# EAGLE design breakout32u2 (EAGLE 5.12)
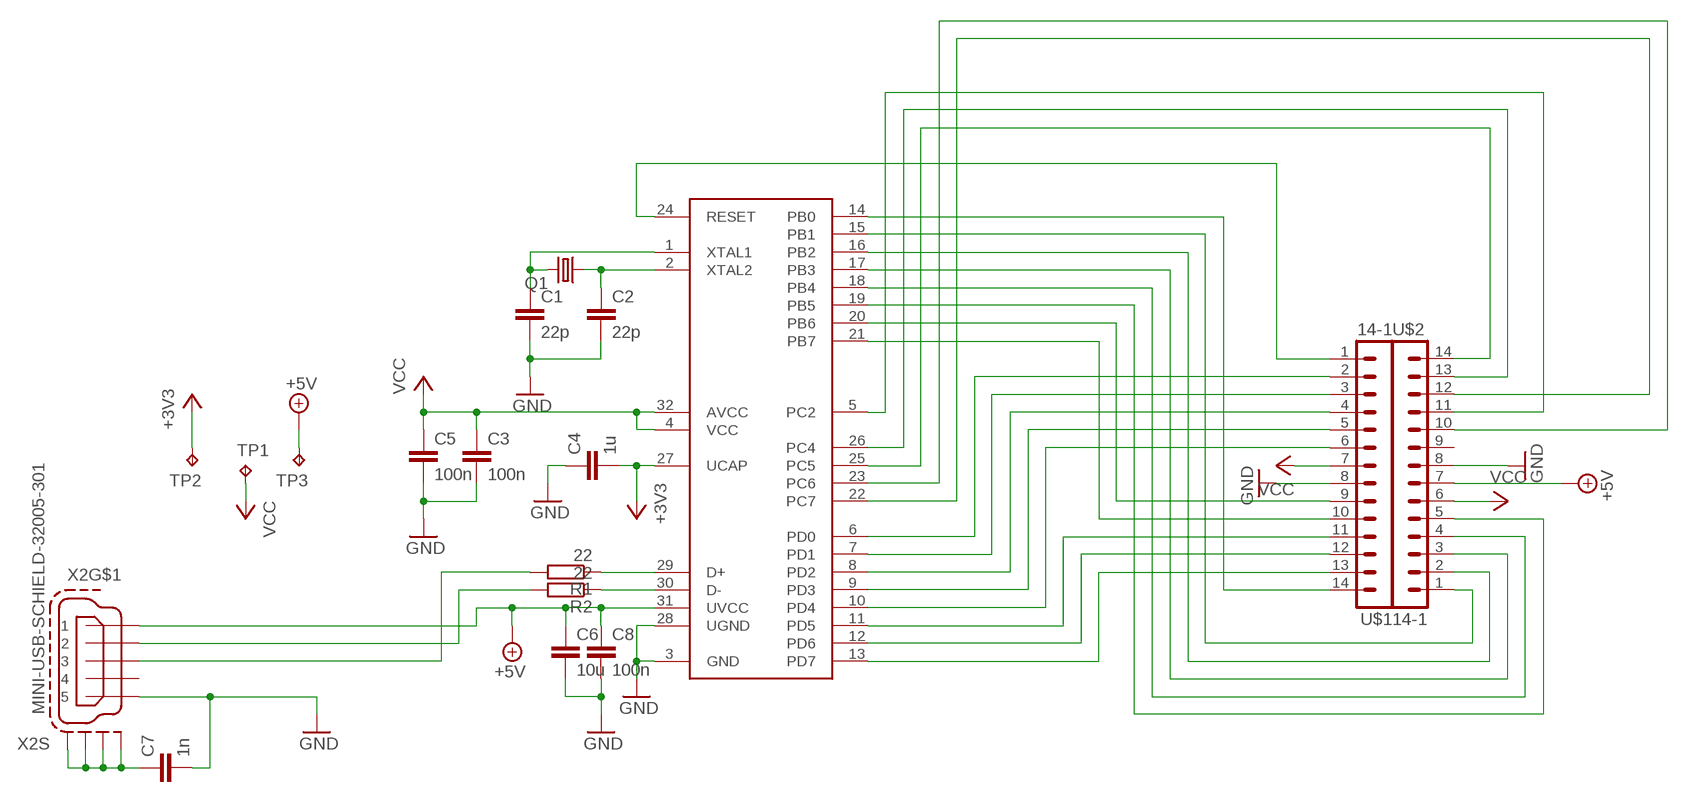
[diagram p0: schematic, sheet 1]

## Parts
C1  22p  C-EUC0805K  [C0805K]
C2  22p  C-EUC0805K  [C0805K]
C3  100n  C-EUC0805K  [C0805K]
C4  1u  C-EUC0805K  [C0805K]
C5  100n  C-EUC0805K  [C0805K]
C6  10u  C-EUC0805K  [C0805K]
C7  1n  C-EUC0805K  [C0805K]
C8  100n  C-EUC0805K  [C0805K]
IC1  ATMEGA32U2  AT90USB162  [VQFP32]
Q1  CRYSTALHC49U-V  [HC49U-V]
R1  22  R-EU_M0805  [M0805]
R2  22  R-EU_M0805  [M0805]
TP1  TPTP08SQ  [TP08SQ]
TP2  TPTP08SQ  [TP08SQ]
TP3  TPTP08SQ  [TP08SQ]
U$1  14-1  [14-1]
U$2  14-1  [14-1]
X2  MINI-USB-SCHIELD-32005-301  [32005-301]

## Nets
+3V3: C4.2 IC1.27(UCAP) TP2.TP
+5V: C6.1 C8.1 IC1.31(UVCC) TP3.TP U$2.7 X2.1
GND: C1.2 C2.2 C3.2 C4.1 C5.2 C6.2 C7.2 C8.2 IC1.3(GND) IC1.28(UGND) U$1.8 U$2.8 X2.5
N$1: IC1.29(D+) R1.1
N$2: IC1.30(D-) R2.1
N$3: C7.1 X2.M1(S:S1) X2.M2(S:S2) X2.M3(S:S3) X2.M4(S:S4)
N$5: C1.1 IC1.1(XTAL1) Q1.2
N$6: R2.2 X2.2
N$7: R1.2 X2.3
N$8: IC1.24(RESET) U$1.1
N$9: IC1.14(PB0) U$1.14
N$10: IC1.15(PB1) U$2.1
N$11: IC1.16(PB2) U$2.2
N$12: IC1.17(PB3) U$2.3
N$13: IC1.18(PB4) U$2.4
N$14: IC1.19(PB5) U$2.5
N$15: IC1.20(PB6) U$1.9
N$16: IC1.21(PB7) U$1.10
N$17: IC1.6(PD0) U$1.2
N$18: IC1.7(PD1) U$1.3
N$19: IC1.8(PD2) U$1.4
N$20: IC1.9(PD3) U$1.5
N$21: IC1.10(PD4) U$1.6
N$22: IC1.11(PD5) U$1.11
N$23: IC1.12(PD6) U$1.12
N$24: IC1.13(PD7) U$1.13
N$25: IC1.5(PC2) U$2.11
N$26: IC1.26(PC4) U$2.13
N$27: IC1.25(PC5) U$2.14
N$28: IC1.23(PC6) U$2.10
N$29: IC1.22(PC7) U$2.12
N$30: C2.1 IC1.2(XTAL2) Q1.1
VCC: C3.1 C5.1 IC1.4(VCC) IC1.32(AVCC) TP1.TP U$1.7 U$2.6
Unconnected: U$2.9 X2.4

## Library data of the parts
C1-C8 = rcl:C-EU: CAPACITOR, European symbol
IC1 = at90usb:AT90USB162
Q1 = crystal:CRYSTAL: CRYSTAL; OC_FARNELL: 1666969; OC_NEWARK: unknown
R1 R2 = rcl:R-EU_: RESISTOR, European symbol
TP1-TP3 = testpad:TP: Test pad
U$1 U$2 = adi__con-lstb:14-1
X2 = con-cypressindustries:MINI-USB-SCHIELD-: MINI USB-B Conector Source: www.cypressindustries.com; OC_FARNELL: unknown; OC_NEWARK: unknown

## Board
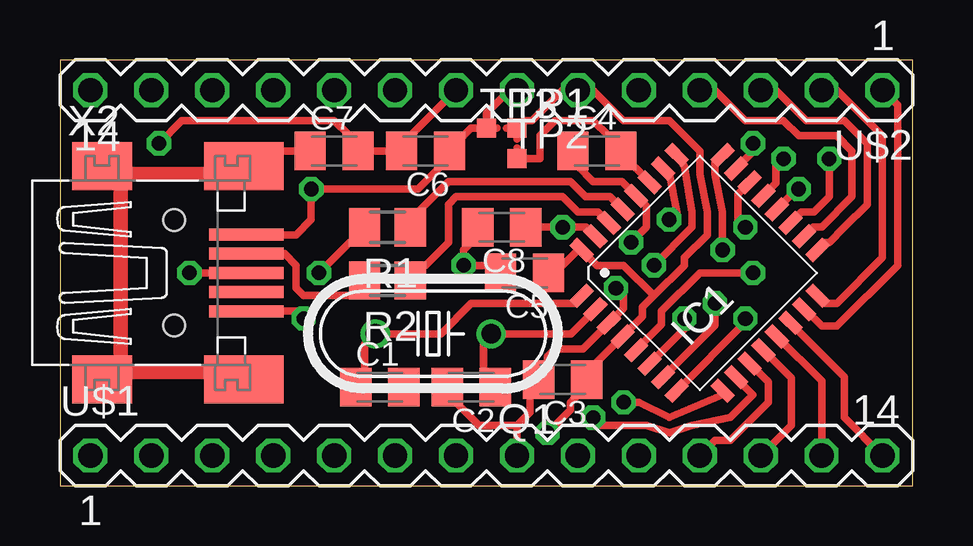
[diagram p1: board, top side]
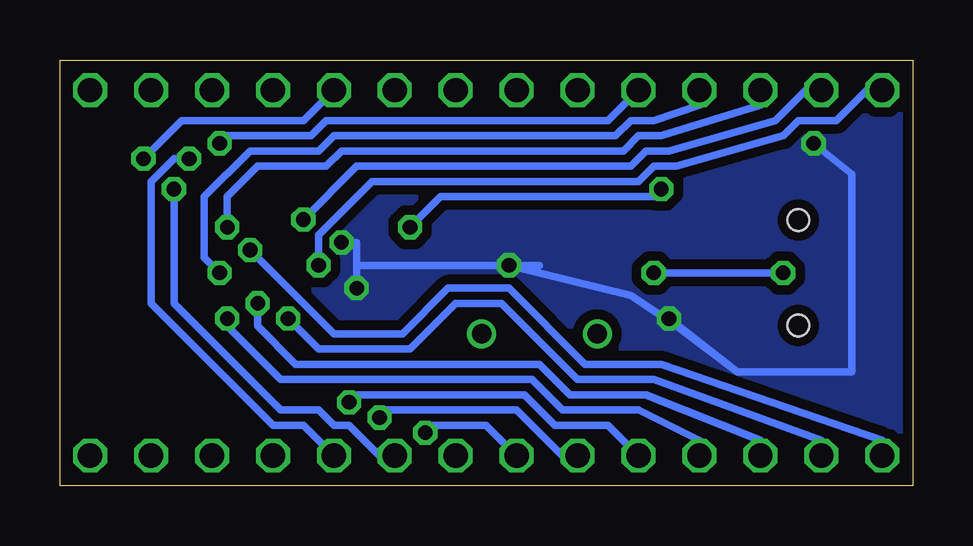
[diagram p2: board, bottom side, seen from below]

Size 35.55 x 17.77 mm. Coordinates in mm from the lower left corner, seen from the top.
Outline: 0,0 35.55,0 35.55,17.77 0,17.77 0,0
Copper layers (1*16): Top 0.035mm / dielectric 1.5mm / Bottom 0.035mm
Design rules "default": minimum track width 0.2mm, minimum drill 0.5mm, track to track 0.2mm, track to pad 0.2mm, pad to pad 0.15mm, via to via 0.2mm, smd to smd 0mil, copper to edge 0.2mm, drill to drill 0.2mm, minimum pad ring 0.2mm, minimum via ring 0.2mm, stop-mask expansion 0.1mm, vias tented up to drill 0mil, thermal gap 10mil

### Footprints (pad centres in the part's own frame; a part is rotated, then mirrored left to right if it is on the bottom)
C0805K = smd 1.3 x 1.6: 1 -1,0; 2 1,0
VQFP32 = smd 1 x 0.45: 1 -4.15,2.8; 2 -4.15,2; 3 -4.15,1.2; 4 -4.15,0.4; 5 -4.15,-0.4; 6 -4.15,-1.2; 7 -4.15,-2; 8 -4.15,-2.8; 17 4.15,-2.8; 18 4.15,-2; 19 4.15,-1.2; 20 4.15,-0.4; 21 4.15,0.4; 22 4.15,1.2; 23 4.15,2; 24 4.15,2.8 | smd 0.45 x 1: 9 -2.8,-4.15; 10 -2,-4.15; 11 -1.2,-4.15; 12 -0.4,-4.15; 13 0.4,-4.15; 14 1.2,-4.15; 15 2,-4.15; 16 2.8,-4.15; 25 2.8,4.15; 26 2,4.15; 27 1.2,4.15; 28 0.4,4.15; 29 -0.4,4.15; 30 -1.2,4.15; 31 -2,4.15; 32 -2.8,4.15
HC49U-V = drill 0.813 round: 1 -2.413,0; 2 2.413,0
M0805 = smd 1.3 x 1.6: 1 -0.95,0; 2 0.95,0
TP08SQ = smd 0.8 x 0.8: TP 0,0
14-1 = drill 1.016 octagon: 1 -15.24,0; 2 -12.7,0; 3 -10.16,0; 4 -7.62,0; 5 -5.08,0; 6 -2.54,0; 7 0,0; 8 2.54,0; 9 5.08,0; 10 7.62,0; 11 10.16,0; 12 12.7,0; 13 15.24,0; 14 17.78,0
32005-301 = smd 3.1 x 0.5: 1 3,1.6; 2 3,0.8; 3 3,0; 4 3,-0.8; 5 3,-1.6 | smd 2.5 x 2: M1 -3,-4.45; M2 -3,4.45 | smd 3.3 x 2: M3 2.9,4.45; M4 2.9,-4.45 | hole 0.9: 0,2.2; 0,-2.2

### Placement (x,y rotation side)
C1  13.34,4.13 0 top
C2  17.14,4.13 180 top
C3  20.95,4.45 180 top
C4  22.38,13.97 0 top
C5  19.37,8.89 180 top
C6  15.24,13.97 180 top
C7  11.43,13.97 0 top
C8  18.41,10.79 180 top
IC1  26.67,8.89 45 top
Q1  15.56,6.35 180 top
R1  13.65,10.79 180 top
R2  13.65,8.57 180 top
TP1  19.05,14.92 0 top
TP2  19.05,13.65 0 top
TP3  17.78,14.92 0 top
U$1  16.51,1.27 0 top
U$2  19.05,16.51 180 top
X2  4.76,8.89 0 top

### Tracks (layer width: path | path; a pad name or v marks a point on that pad's centre or on a via)
+3V3
  Top 0.305: IC1.27 23.29,13.97 C4.2 22.86,14.61 22.23,15.24 20.64,15.24 20,14.61 20,13.65 TP2.TP 19.05,14.1
+5V  (via drill 0.61, 0.61 pad 0.81)
  Top 0.305: IC1.31 21.94,10.79 v20.95,10.79 C8.1 | 7.29,10.49 X2.1 8.08,10.48 9.84,10.48 10.48,11.11 v10.48,12.38 14.92,12.38 15.88,13.34 15.88,13.61 C6.1 16.51,14.24 16.51,14.29 17.14,14.92 TP3.TP | U$2.7 18.73,16.51 17.78,15.56 TP3.TP | TP3.TP 18.23,14.92
  Bottom 0.305: v20.95,10.79 19.68,12.06 10.79,12.06 v10.48,12.38
GND  (via drill 0.61)
  Top 0.305: X2.5 7.43,7.3 9.84,7.3 v10.16,6.99 | C4.1 21.59,13.61 21.59,13.34 22.23,12.7 23.43,12.7 IC1.28 24.45,11.68 24.45,10.79 v23.81,10.16 | v4.13,14.29 5.08,15.24 11.43,15.24 12.06,14.61 C7.2 C6.2 14.61,14.34 14.61,14.61 U$2.8 | v23.18,8.26 23.5,7.94 23.5,7.41 IC1.3 21.8,5.71 20.64,5.71 20.32,5.4 20.32,4.81 C3.2 19.59,4.08 19.59,3.08 19.05,2.54 | C2.2 C1.2 | C2.2 15.83,3.86 | 19.05,2.54 17.46,2.54 16.51,3.49 16.51,3.76 C2.2 | 19.05,2.54 U$1.8 | 18.37,9.21 v16.83,9.21 16.83,9.84 17.14,10.16 17.14,10.53 C8.2
  Top 0.406: C8.2 17.46,10.79 | 18.37,9.21 C5.2
  Bottom 0.305: 23.18,9.21 v23.18,8.26 | v16.83,9.21 15.56,9.21 | v16.83,9.21 23.18,9.21 | 23.18,9.21 23.18,10.16 v23.81,10.16 | 7.3,4.76 9.84,6.67 11.75,7.94 v16.83,9.21 | 7.3,4.76 v10.16,6.99 | v4.13,14.29 2.54,13.02 2.54,4.76 7.3,4.76
  pour Bottom (isolate 0.406): -2.86,16.19 -2.86,1.59 38.1,1.59 38.1,16.19
N$1
  Top 0.305: R1.1 14.61,11.11 16.19,12.7 21.27,12.7 21.91,12.06 22.93,12.06 IC1.29
N$2
  Top 0.305: R2.1 14.6,8.89 14.61,9.21 15.24,9.21 16.19,10.16 16.19,11.75 16.51,12.06 20.95,12.06 21.59,11.43 22.43,11.43 IC1.30
N$3
  Top 0.305: C7.1 7.62,13.97 7.34,13.7 X2.M3 | X2.M1 2.54,4.93 | 2.54,12.85 X2.M2
  Top 0.61: X2.M2 2.22,13.34 2.86,13.02 6.99,13.02 X2.M3 | X2.M1 2.54,4.44 2.54,4.76 6.99,4.76 X2.M4 | 2.54,4.93 2.54,12.85
N$5
  Top 0.305: IC1.1 21.44,7.62 17.14,7.62 15.88,6.35 Q1.2 12.7,5.91 12.7,4.45 12.83,4.62 C1.1
N$6
  Top 0.305: X2.2 9.36,9.69 9.84,9.21 9.84,8.26 10.16,7.94 12.7,7.94 | 12.7,7.94 12.38,9.21 12.7,7.94 | 12.7,7.94 R2.2
N$7  (via drill 0.61 pad 0.81)
  Top 0.305: v5.4,8.89 X2.3 | v10.79,8.89 12.06,10.16 12.38,10.16 R1.2
  Bottom 0.305: v5.4,8.89 v10.79,8.89
N$8  (via drill 0.61)
  Top 0.305: IC1.24 27.3,13.48 27.3,13.02 27.62,11.43 v27.62,9.84
  Bottom 0.305: U$1.1 1.27,1.91 10.48,5.08 13.65,5.08 16.83,8.26 19.37,8.26 21.27,6.35 24.13,6.35 v27.62,9.84
N$9
  Top 0.305: IC1.14 32.7,4.55 32.7,2.86 U$1.14
N$10
  Top 0.305: IC1.15 31.05,7.37 31.75,6.67 32.38,6.67 34.92,9.21 34.92,15.88 U$2.1
N$11
  Top 0.305: U$2.2 32.38,16.51 34.29,14.61 34.29,9.53 32.38,7.62 31.9,7.62 IC1.16
N$12
  Top 0.305: U$2.3 29.84,16.51 31.11,15.24 32.7,15.24 33.66,14.29 33.66,11.75 32.7,10.79 32.07,10.16 31.9,10.16 IC1.17
N$13
  Top 0.305: U$2.4 27.3,16.51 28.57,15.24 30.16,15.24 30.8,14.61 32.38,14.61 33.02,13.97 33.02,12.06 31.75,10.79 31.4,10.79 IC1.18
N$14  (via drill 0.61)
  Top 0.305: IC1.19 30.91,11.43 31.43,11.43 32.07,12.06 v32.07,13.65
  Bottom 0.305: U$2.5 25.4,15.24 30.48,15.24 v32.07,13.65
N$15  (via drill 0.61)
  Top 0.305: IC1.20 30.73,12.38 v30.8,12.38
  Bottom 0.305: U$1.9 22.23,1.27 23.5,2.54 24.13,2.54 24.77,3.17 26.35,3.17 30.8,7.62 v30.8,12.38
N$16  (via drill 0.61)
  Top 0.305: IC1.21 29.84,12.63 29.84,13.34 v30.16,13.65
  Bottom 0.305: U$1.10 25.4,2.54 26.67,2.54 31.75,7.62 31.75,12.7 30.8,13.65 v30.16,13.65
N$17  (via drill 0.61)
  Top 0.305: IC1.6 26.04,6.56 v26.04,6.99
  Bottom 0.305: U$1.2 3.81,1.91 10.79,4.45 13.97,4.45 17.14,7.62 19.05,7.62 20.95,5.71 24.77,5.71 v26.04,6.99
N$18  (via drill 0.61)
  Top 0.305: IC1.7 27.3,6.7 v27.3,7.62
  Bottom 0.305: U$1.3 6.35,1.91 11.11,3.81 14.29,3.81 15.56,5.08 25.72,5.08 27.3,6.67 v27.3,7.62
N$19  (via drill 0.61)
  Top 0.305: IC1.8 28.57,6.83 v28.57,6.99
  Bottom 0.305: U$1.4 8.89,1.91 11.43,3.17 14.61,3.17 15.88,4.45 26.35,4.45 28.57,6.67 v28.57,6.99
N$20  (via drill 0.61)
  Top 0.305: v23.5,3.49 24.13,3.49 25.4,2.86 27.62,3.81 IC1.9
  Bottom 0.305: U$1.5 12.7,2.54 14.92,2.54 16.19,3.81 23.18,3.81 v23.5,3.49
N$21  (via drill 0.61)
  Top 0.305: v22.23,2.86 22.54,2.54 24.45,2.54 25.4,2.22 26.35,2.54 27.94,2.86 28.89,3.81 28.19,4.51 IC1.10
  Bottom 0.305: U$1.6 14.61,1.27 16.51,3.17 21.91,3.17 v22.23,2.86
N$22
  Top 0.305: U$1.11 27.3,1.91 27.94,1.91 29.53,3.49 29.53,4.33 IC1.11
N$23
  Top 0.305: IC1.12 30.48,4.51 30.48,2.54 U$1.12
N$24
  Top 0.305: IC1.13 31.75,4.38 U$1.13
N$25  (via drill 0.61)
  Top 0.305: IC1.5 25.08,6.74 25.08,7.3 26.67,8.89 v28.89,8.89
  Bottom 0.305: U$2.11 8.89,15.88 10.79,15.24 11.75,15.24 12.38,14.61 24.13,14.61 24.77,13.97 27.62,13.97 29.53,12.06 29.53,9.53 v28.89,8.89
N$26  (via drill 0.61)
  Top 0.305: IC1.26 25.4,12.99 25.4,13.02 25.72,11.43 v25.4,11.11
  Bottom 0.305: U$2.13 4.45,16.51 5.71,15.24 10.16,13.97 11.11,13.97 11.75,13.34 23.18,13.34 v25.4,11.11
N$27  (via drill 0.61)
  Top 0.305: v24.77,9.21 26.35,10.79 26.35,11.43 26.04,13.34 IC1.25
  Bottom 0.305: U$2.14 1.91,16.51 3.17,15.24 4.76,15.24 5.4,14.61 9.84,13.34 10.79,13.34 11.43,12.7 22.54,12.7 24.77,10.48 v24.77,9.21
N$28  (via drill 0.61)
  Top 0.305: v28.89,14.29 28.89,13.94 IC1.23
  Bottom 0.305: U$2.10 12.7,15.24 24.45,15.24 25.08,14.61 28.57,14.61 v28.89,14.29
N$29  (via drill 0.61)
  Top 0.305: IC1.22 28.26,12.18 28.26,11.11 v28.57,10.79
  Bottom 0.305: U$2.12 6.35,15.88 10.48,14.61 11.43,14.61 12.06,13.97 23.81,13.97 24.45,13.34 27.3,13.34 28.57,12.06 v28.57,10.79
N$30
  Top 0.305: IC1.2 21.3,6.35 Q1.1 18.1,6.35 17.65,5.91 17.65,4.62 C2.1
VCC  (via drill 0.61)
  Top 0.305: C5.1 20.37,9.21 20.95,9.21 21.59,9.85 IC1.32 22.39,9.21 23.5,9.21 24.77,7.94 | v20.32,2.22 21.27,3.17 21.27,3.49 21.59,3.81 21.59,4.08 C3.1 21.95,4.74 IC1.4 24.29,7.07 24.29,7.46 24.77,7.94 | 24.77,7.94 26.04,9.21 26.04,9.53 26.99,10.48 26.99,11.43 26.67,13.02 26.67,13.97 25.4,15.24 23.5,15.24 22.23,16.51 U$2.6 20.95,16.51 19.68,15.24 19.37,15.24 TP1.TP | TP1.TP 18.61,14.92 | TP1.TP 19.05,14.48
  Bottom 0.305: v20.32,2.22 20,2.54 17.78,2.54 U$1.7